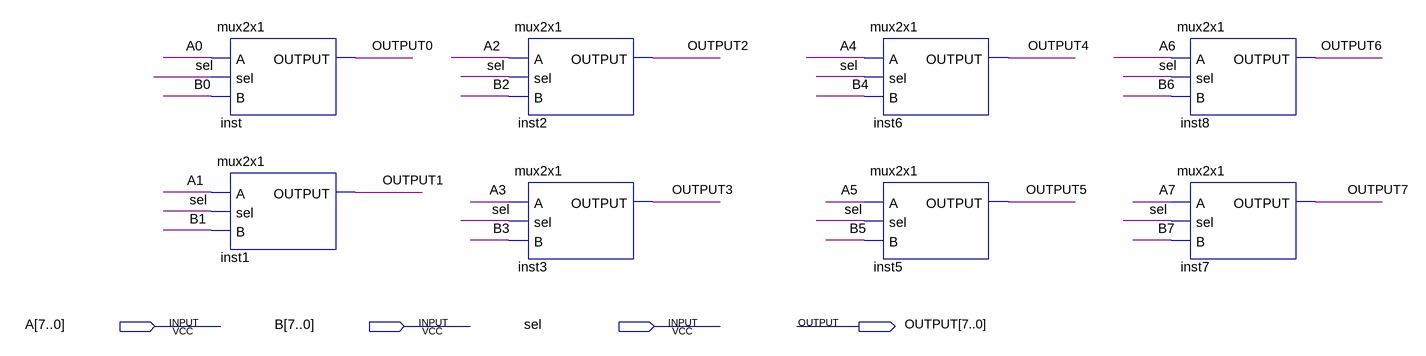
[diagram p0: schematic sheet]
// Quartus schematic mux2x18bits.bdf as structural Verilog: 8 symbols, 4 pins
module mux2x18bits (
  input  [7:0] A,
  input  [7:0] B,
  input  sel,
  output [7:0] OUTPUT
);

  mux2x1 inst (.A(A[0]), .sel(sel), .B(B[0]), .OUTPUT(OUTPUT[0]));
  mux2x1 inst1 (.A(A[1]), .sel(sel), .B(B[1]), .OUTPUT(OUTPUT[1]));
  mux2x1 inst2 (.A(A[2]), .sel(sel), .B(B[2]), .OUTPUT(OUTPUT[2]));
  mux2x1 inst3 (.A(A[3]), .sel(sel), .B(B[3]), .OUTPUT(OUTPUT[3]));
  mux2x1 inst6 (.A(A[4]), .sel(sel), .B(B[4]), .OUTPUT(OUTPUT[4]));
  mux2x1 inst5 (.A(A[5]), .sel(sel), .B(B[5]), .OUTPUT(OUTPUT[5]));
  mux2x1 inst8 (.A(A[6]), .sel(sel), .B(B[6]), .OUTPUT(OUTPUT[6]));
  mux2x1 inst7 (.A(A[7]), .sel(sel), .B(B[7]), .OUTPUT(OUTPUT[7]));
endmodule
